# Altium schematic sheet Schematic.SchDoc
size A; SheetNumber: 1; SheetTotal: 1
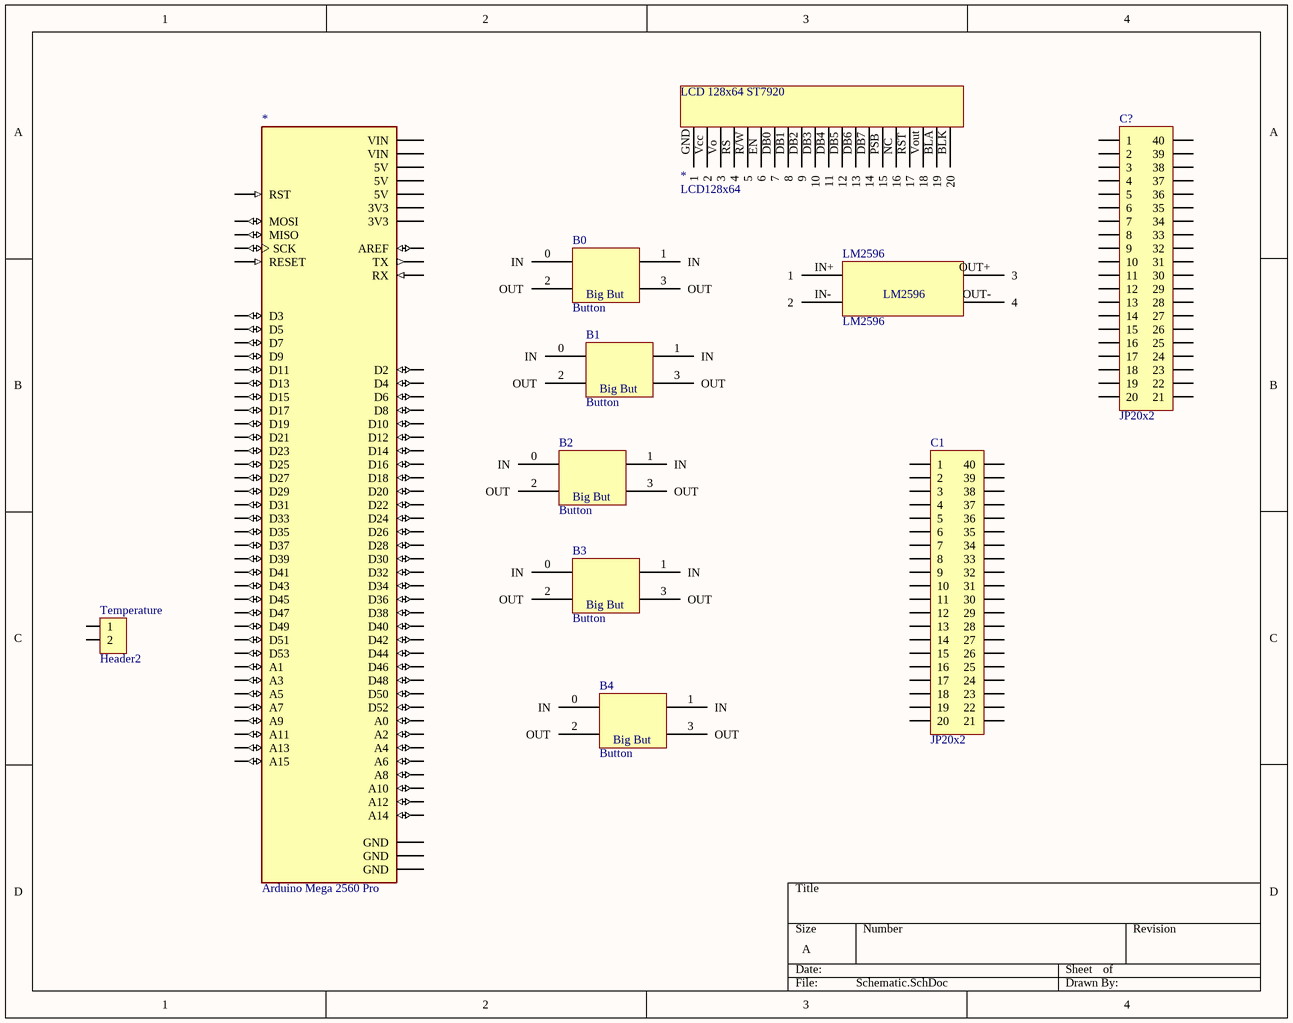
[diagram p0: Schematic.SchDoc]

## Parts
(Parts that share a designator on the sheet are numbered #1, #2 ... from top to bottom, then left to right.)
*#1  LCD128x64  [LCD 128x64]
*#2  Arduino Mega 2560 Pro  [Arduino Mega 2560 Pro]
B0  Button  [Button]
B1  Button  [Button]
B2  Button  [Button]
B3  Button  [Button]
B4  Button  [Button]
C1  JP20x2  [JP20-C2T]
C?  JP20x2  [JP20-C2T]
LM2596  LM2596  [LM2596]
Temperature  Header2  [HDR2]

## Nets

Not connected (* = marked no-connect by the designer): *#1 BLA(19) BLK(20) DB0(7) DB1(8) DB2(9) DB3(10) DB4(11) DB5(12) DB6(13) DB7(14) EN(6) GND(1) NC(16) PSB(15) R/W(5) RS(4) RST(17) Vcc(2) Vo(3) Vout(18); *#2 3V3_1(3V3) 3V3_2(3V3) 5V_1(5V) 5V_2(5V) 5V_3(5V) A0 A1 A2 A3 A4 A5 A6 A7 A8 A9 A10 A11 A12 A13 A14 A15 AREF D2 D3 D4 D5 D6 D7 D8 D9 D10 D11 D12 D13 D14 D15 D16 D17 D18 D19 D20 D21 D22 D23 D24 D25 D26 D27 D28 D29 D30 D31 D32 D33 D34 D35 D36 D37 D38 D39 D40 D41 D42 D43 D44 D45 D46 D47 D48 D49 D50 D51 D52 D53 GND_1(GND) GND_2(GND) GND_3(GND) MISO MOSI RESET RST RX SCK TX VIN_1(VIN) VIN_2(VIN); B0 0(IN) 1(IN) 2(OUT) 3(OUT); B1 0(IN) 1(IN) 2(OUT) 3(OUT); B2 0(IN) 1(IN) 2(OUT) 3(OUT); B3 0(IN) 1(IN) 2(OUT) 3(OUT); B4 0(IN) 1(IN) 2(OUT) 3(OUT); C1 1 2 3 4 5 6 7 8 9 10 11 12 13 14 15 16 17 18 19 20 21 22 23 24 25 26 27 28 29 30 31 32 33 34 35 36 37 38 39 40; C? 1 2 3 4 5 6 7 8 9 10 11 12 13 14 15 16 17 18 19 20 21 22 23 24 25 26 27 28 29 30 31 32 33 34 35 36 37 38 39 40; LM2596 IN+(1) IN-(2) OUT+(3) OUT-(4); Temperature 1 2

## Notes on the sheet
- (in symbol Button) Big But
- (in symbol LCD128x64) LCD 128x64 ST7920

## Library data of the parts
B0-B4 = Button: BigBoob
C1 C? = JP20x2: WR-PHD 2.54 mm Dual Socket Header; Manufacturer: W¨¹rth Elektronik eiSos GmbH; partNo: 61304021821; ComponentLink1 Description: Manufacturer; ComponentLink2 Description: Datasheet; NoPins: 40; Created Date: 29 March 2013; ComponentLink1URL: http://www.we-online.com; ComponentLink2URL: http://katalog.we-online.de/em/datasheet/6130xx21821.pdf; Created by: Karrer Zheng
Temperature = Header2: Header IDC, 2 x 1 Pin Vertical 2.54mm Pitch (Non-Boxed, Male); Manufacturer: W¨¹rth Elektronik eiSos GmbH; partNo: 613002143121; ComponentLink1 Description: Manufacturer; ComponentLink2 Description: Datasheet; NoPins: 02; Created Date: 29 March 2013; ComponentLink1URL: http://www.we-online.com; ComponentLink2URL: http://katalog.we-online.de/em/datasheet/6130xx143121.pdf; Created by: Karrer Zheng